# Altium schematic sheet power.SchDoc
size A; SheetNumber: 1; SheetTotal: 3; SPICEModelCacheMNSYNCZO: <root> / <DocumentId>MNSYNCZO</DocumentId> / </root>
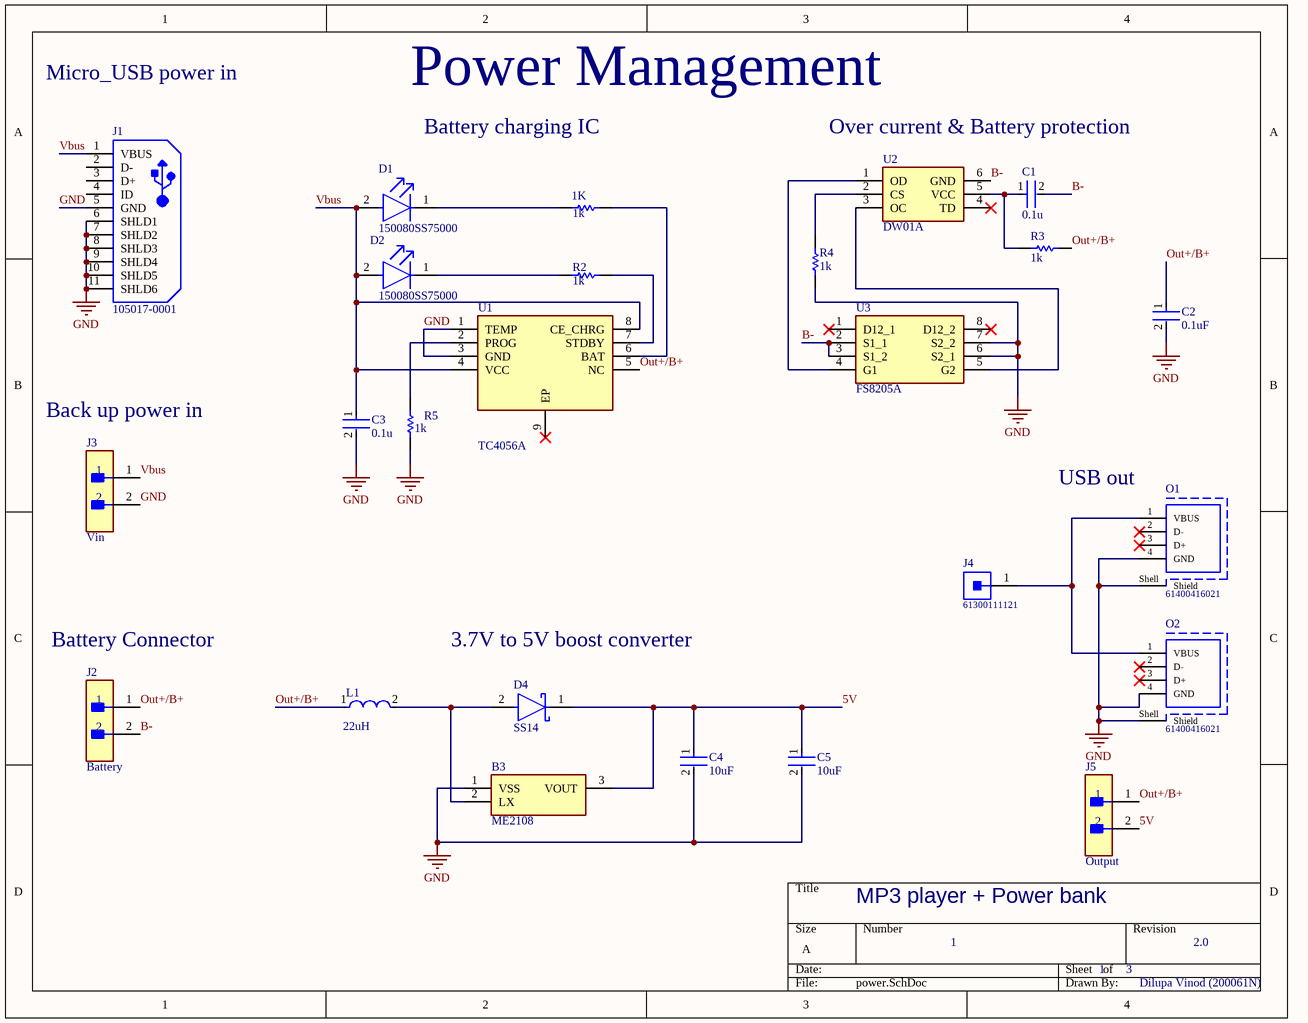
[diagram p0: power.SchDoc]

## Parts
1K  1k  [RESC2013X50X30LL20T20]
B3  ME2108  [SOT95P250X130-3N]
C1  0.1u  [FP-CL10-IPC_C]
C2  0.1uF  [FP-C0805C-DN-MFG]
C3  0.1u  [FP-C0805C-DN-MFG]
C4  10uF  [FP-C0805C-DN-MFG]
C5  10uF  [FP-C0805C-DN-MFG]
D1  150080SS75000  [FP-150080SS75000-MFG]
D2  150080SS75000  [FP-150080SS75000-MFG]
D4  SS14  [FP-95400-MFG]
J1  105017-0001  [USB-MICRO-B_V]
J2  Battery  [FP-M20-9990246-MFG]
J3  Vin  [FP-M20-9990246-MFG]
J4  61300111121  [61300111121]
J5  Output  [FP-M20-9990246-MFG]
L1  22uH  [FP-NR6045-MFG]
O1  61400416021  [61400416021]
O2  61400416021  [61400416021]
R2  1k  [RESC2013X50X30LL20T20]
R3  1k  [RESC2013X50X30LL20T20]
R4  1k  [RESC2013X50X30LL20T20]
R5  1k  [RESC2013X50X30LL20T20]
U1  TC4056A  [SOIC127P600X175-9N]
U2  DW01A  [SOT95P280X135-6N]
U3  FS8205A  [SOP65P640X120-8N]

## Nets
GND: B3.1(VSS) C2.2 C3.2 C4.2 C5.2 J1.5(GND) J1.6(SHLD1) J1.7(SHLD2) J1.8(SHLD3) J1.9(SHLD4) J1.10(SHLD5) J1.11(SHLD6) J3.2 O1.4(GND) O1.Shell(Shield) O2.4(GND) O2.Shell(Shield) R4.1 R5.1 U1.1(TEMP) U1.3(GND) U3.6(S2_1) U3.7(S2_2)
5V: B3.3(VOUT) C4.1 C5.1 D4.1(C) J5.2
B-: C1.2 J2.2 U2.6(GND) U3.2(S1_1) U3.3(S1_2)
Out+/B+: C2.1 J2.1 J5.1 L1.1 R3.1 U1.5(NC)
Vbus: C3.1 D1.2(A) D2.2(A) J1.1(VBUS) J3.1 U1.4(VCC) U1.8(CE_CHRG)
Net1K_1: 1K.1 D1.1(C)
Net1K_2: 1K.2 U1.6(BAT)
NetB3_2: B3.2(LX) D4.2(A) L1.2
NetC1_1: C1.1 R3.2 U2.5(VCC)
NetD2_1: D2.1(C) R2.1
NetJ4_1: J4.1 O1.1(VBUS) O2.1(VBUS)
NetR2_2: R2.2 U1.7(STDBY)
NetR4_2: R4.2 U2.2(CS)
NetR5_2: R5.2 U1.2(PROG)
NetU2_1: U2.1(OD) U3.4(G1)
NetU2_3: U2.3(OC) U3.5(G2)

Not connected (* = marked no-connect by the designer): J1 2(D-) 3(D+) 4(ID); O1 2(D-)* 3(D+)*; O2 2(D-)* 3(D+)*; U1 9(EP)*; U2 4(TD)*; U3 1(D12_1)* 8(D12_2)*

## Notes on the sheet
- Micro_USB power in
- Power Management
- Battery charging IC
- Over current & Battery protection
- Back up power in
- (near O1) USB out
- Battery Connector
- 3.7V to 5V boost converter
- MP3 player + Power bank
- 1
- 3
- 2.0
- Dilupa Vinod (200061N)

## Library data of the parts
1K R2-R5 = CMP-2001-04896-1: Manufacturer: Vishay Dale; Part Number: CRCW08050000Z0EA
B3 = ME2108A33M3G: 6.5V 400mA SOT-23(SOT-23-3) DC-DC Converters RoHS; Manufacturer_Name: Microne; Geometry.Height: 1.3mm; Manufacturer_Part_Number: ME2108A33M3G; Mouser Part Number: *; Mouser Price/Stock: *; Arrow Part Number: *; Arrow Price/Stock: *; Datasheet Link: https://datasheet.lcsc.com/szlcsc/Nanjing-Micro-One-Elec-ME2108A50M3G_C14839.pdf
C1 = CMP-13271-003283-1: Cap Ceramic 100nF 16V X7R ±5% Pad SMD 0603 +125°C T/R; Material: Ceramic; Max Operating Temperature: 125°C; Lead Free: Lead Free; Radiation Hardening: No; Mount: Surface Mount; Voltage Rating: 16V; Height: 0.8mm; Min Operating Temperature: -55°C; Voltage Rating (DC): 16V; Tolerance: 5%; Width: 0.031inch; Packaging: Tape and Reel; Capacitance: 100nF; Depth: 0.8mm; Case/Package: 0603; Package Quantity: 10000; Length: 1.6mm; Thickness: 0.035inch; Dielectric: X7R
C2-C5 = CMP-1036-04552-2: CAP CER 0.22UF 50V X7R 0805; Manufacturer: KEMET; Manufacturer Part Number: C0805C224K5RACTU; Value: 0.22 μF; Temperature Coefficient: 30ppm/°C; Material: Ceramic; Tolerance: 0.1; ComponentLink2URL: https://content.kemet.com/datasheets/KEM_C1003_C0G_SMD.pdf; Temperature Characteristic: X7R; Device Class L3: Ceramic Capacitors; Lead Free: Yes; Temperature: -55°C to +125°C; RoHS: TRUE; Capacitance: 0.22 μF; Automotive: No; Octopart: https://octopart.com/c0805c224k5ractu-kemet-144670; Temperature Range Low: -55°C; Height: 0.88mm; Device Class L1: Passive Components; Digikey Description: CAP CER 0.22UF 50V X7R 0805; ComponentLink2Description: Datasheet; Mouser Description: CAP CER 0.22UF 50V X7R 0805; Category: Cap; Ipc Land Pattern Name: CAPC200125X78; Temperature Range High: +125°C; Package: C0805C-DN; Device Class L2: Capacitors; Voltage Rating: 50 V
D1 D2 = CMP-1426-00010-2: LED RED CLEAR 0805 SMD; Forward Voltage: 1.9V; Luminous Intensity: 60mcd; Dominant Wavelength: 630nm; Forward Current: 30mA; Viewing Angle: 140°; Lens Color: Colorless; Test Current: 20mA; Lens Size: 1.25mm; Packaging: Cut Tape; Width: 1.25mm; Case Code (Metric): 2012; Max Operating Temperature: 85°C; RoHS Compliant: Yes; Mount: Surface Mount; Case/Package: 0805; Series: WL-SMCW; Length: 2mm; Case Code (Imperial): 0805; Wavelength: 630nm; Lens Style: Clear; Min Operating Temperature: -40°C; Color: Red; Lens Transparency: Clear; Package Quantity: 1; Height: 0.8mm
D4 = CMP-02539-000035-1: DIODE SCHOTTKY 40V 1A DO214AC; Manufacturer: Vishay; Manufacturer Part Number: SS14-E3/61T; Peak Reverse Current: 0.2mA; Standoff Height: 0mm; Max Junction Temp: +150°C; Max Surge Forward Current: 40A; RoHS: TRUE; Digikey Description: DIODE SCHOTTKY 40V 1A DO214AC; Category: Diode; Device Class L3: Schottky Diodes; Temperature Range High: +150°C; Automotive: No; Temperature: -65°C to +150°C; Device Class L2: Diodes; Forward Current: 1A; Temperature Range Low: -65°C; Footprint Url: http://www.vishay.com/docs/95400/sma.pdf; Octopart: https://octopart.com/ss14-e3%2F61t-vishay-39552847; Package: 95400; Max Repetitive Reverse Voltage: 40V; ComponentLink2Description: Datasheet; ComponentLink2URL: http://www.vishay.com/docs/88746/ss12.pdf; Lead Free: Yes; Height: 2.29mm; Mouser Description: SS14 Series 40 V 1 A Surface Mount Schottky Barrier Rectifier - DO-214AC (SMA); Device Class L1: Discrete Semiconductors
J1 = CMP-2000-05827-1: Micro-USB B Receptacle, Right Angle, Bottom Mount, Surface Mount, with Solder Tabs, -30 to 85 degC, 5-Pin USB, RoHS, Tape and Reel; Manufacturer: Molex; Featured Product: Micro-USBConnectorsUSBConnectors; Other Names: WM1399DKR; Package Version: Rev. F, 12/2012; Number of Contacts: 5; Connector Type: USB-microB; Catalog Drawings: 1050170001; 3D Model: 105017-0001.stp; Mating Products: WM17145-ND-CABLEMICROUSBBTOSTDA1.0MWM17147-ND-CABLEMICROUSBBTOSTDA2.0MWM17146-ND-CABLEMICROUSBBTOSTDA1.5M; PCN Assembly/Origin: ResinSupplier21/Oct/2015; Voltage - Max: 30V; Online Catalog: Molex-MicroUSB; Manufacturer URL: http://www.molex.com/; Package Description: 5-Leads USB, Micro B, Body 7.5 x 5 mm, Pitch 0.65 mm; Datasheet URL: http://www.molex.com/elqNow/elqRedir.htm?ref=http://www.molex.com/webdocs/datasheets/pdf/en-us/1050170001_IO_CONNECTORS.pdf; Ingress Protection: -; Datasheet Version: 03/2016; Mounting Type: BoardCutout,SurfaceMount,RightAngle; Circuits: 5; Standard Package: 1; Package Reference: MICRO-B; Package URL: http://www.molex.com/pdm_docs/sd/1050170001_sd.pdf; Category: Connectors,Interconnects; Series: -; RoHS Information: 1050170001CertofCompliance; Features: Shielded,SolderRetention; Family: USB,DVI,HDMIConnectors; Specifications: -; Gender: Receptacle; Packaging: Digi-Reel®; Mounting Technology: SurfaceMount
J2 J3 J5 = CMP-15831-000009-1: CONN HEADER VERT 2POS 2.54MM; Manufacturer: Harwin; Manufacturer Part Number: M20-9990246; Conn Gender: Male; Conn Orientation: Vertical; Number Of Contacts: 2; Current Rating: 3A; ComponentLink2URL: https://cdn.harwin.com/pdfs/M20-999.pdf; ComponentLink2Description: Datasheet; Package: M20-9990246; Temperature: -40°C to +105°C; Octopart: https://octopart.com/m20-9990246-harwin-2590635; Mouser Description: 2.54mm (0.1") Pitch SIL Vertical PC Tail Pin Header, 6.1mm mating pin height, tin, 2 contacts; Temperature Range High: +105°C; Device Class L1: Connectors; RoHS: TRUE; Automotive: No; Height: 8.99mm; Number Of Rows: 1; Contact Material: Tin,Nickel; Category: Conn; Pitch: 2.54mm; Lead Free: Yes; Digikey Description: CONN HEADER VERT 2POS 2.54MM; Temperature Range Low: -40°C; Device Class L3: unset; Device Class L2: Headers and Wire Housings
J4 = CMP-1502-01058-1: THT Vertical Pin Header WR-PHD, Pitch 2.54 mm, Single Row, 1 pins; Manufacturer: Wurth Elektronik; Manufacturer: Wurth Electronics; Gender: Male; Working Voltage: 250VAC; Withstanding Voltage: 500VAC; Pin Number: 1; Contact Resistance: 20mOhm; Rated Current: 3A; Pitch: 2.54mm; Mounting Technology: THT; Datasheet URL: https://katalog.we-online.de/em/datasheet/6130xx11121.pdf; Manufacturer URL: http://www.we-online.de; Operating Temperature: -40to105degC; Publisher: WurthElektronik; Part Number: 61300111121; Row Number: Single; Package Reference: 61300111121; Orientation: Vertical; Packaging: Bag; Manufacturer Part Number: 61300111121
L1 = CMP-14484-000872-1: Shielded Wirewound Inductor 22uH 20% 1.5A 0.1495Ω SMD; DC Resistance (DCR): 149.5mR; Self Resonant Frequency: 7MHz; Core Material: Ferrite; Saturation Current: 1.9A; Test Frequency: 100kHz; Mount: Surface Mount; RMS Current (Irms): 1.5A; Packaging: Tape and Reel; RoHS Compliant: Yes; Termination: SMD/SMT; Resistor Type: Wirewound; Inductance: 22uH; Inductance Tolerance: 20%; Number of Pins: 2; Series: NR; Height: 4.5mm; Package Quantity: 1500; Shielding: Shielded; Max Operating Temperature: 120°C; Length: 0.236inch; Halogen Free: Halogen Free; Width: 0.236inch; Min Operating Temperature: -25°C; Current Rating: 1.5A; Height - Seated (Max): 0.177inch; Case/Package: Nonstandard; Max DC Current: 1.5A; Tolerance: 20%
O1 O2 = CMP-1502-03227-1: USB 2.0 Type A Receptacle WR-COM, Horizontal, THT; Manufacturer: Wurth Elektronik; Manufacturer: Wurth Electronics; Working Voltage: 30VAC; Rated Current: 1.5A; Contact Resistance: 20mOhm; Manufacturer URL: http://www.we-online.de; Publisher: WurthElektronik; Packaging: Tray; Operating Temperature: -40to105degC; Orientation: Horizontal; Mounting Technology: THT; Part Number: 61400416021; Gender: Receptacle; Package Reference: 61400416021; Connector Type: USB2.0TypeA; Datasheet URL: https://katalog.we-online.de/em/datasheet/61400416021.pdf; Manufacturer Part Number: 61400416021
U1 = TC4056A: Integrated Circuit; Manufacturer_Name: Shenzhen Fuman Elec; Height: 1.75mm; Manufacturer_Part_Number: TC4056A
U2 = DW01A-G: Integrated Circuit; Manufacturer_Name: Fortune Semiconductor Corporation; Datasheet Link: http://acoptex.com/uploads/DW01A.pdf; Height: 1.35mm; Manufacturer_Part_Number: DW01A-G
U3 = FS8205A: MOSFET (N-Channel); Manufacturer_Name: Fortune Semiconductor Corporation; Datasheet Link: http://www.ic-fortune.com/upload/Download/FS8205A-DS-12_EN.pdf; Height: 1.2mm; Manufacturer_Part_Number: FS8205A